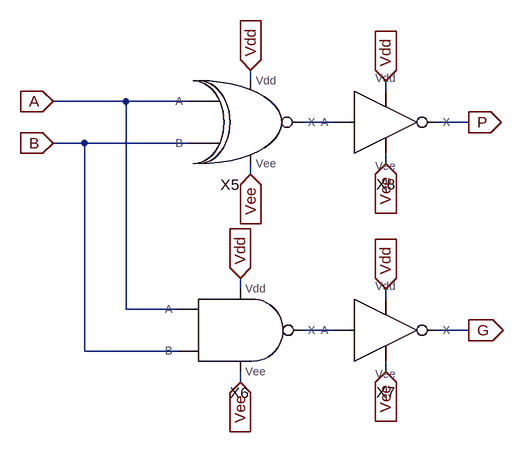
[diagram p0: schematic PG.asc]
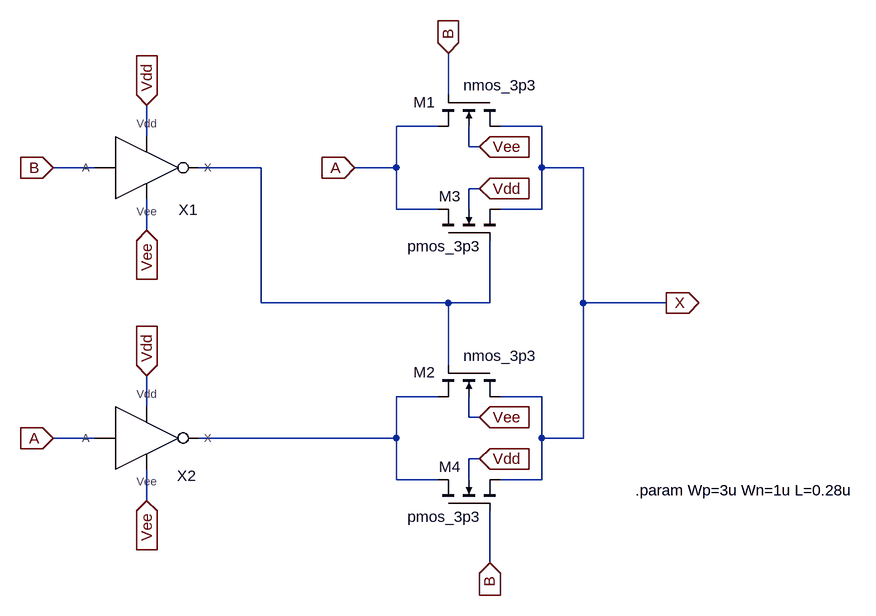
[diagram p1: sub-circuit xnor2x1.asc]
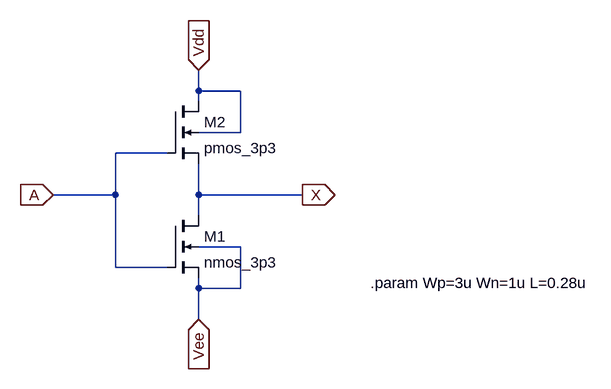
[diagram p2: sub-circuit invx1.asc]
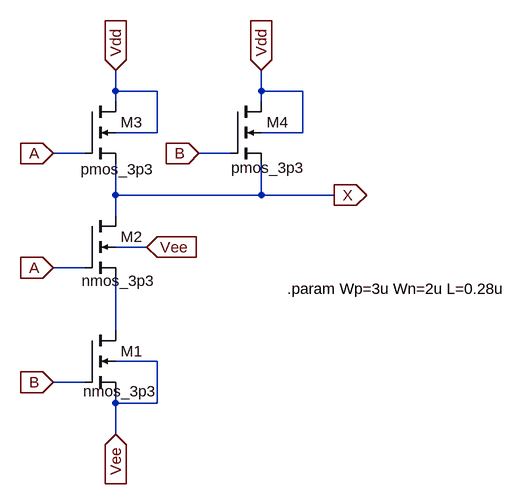
[diagram p3: sub-circuit nand2x1.asc]
PG.asc, the LTspice schematic file:
Version 4.1
SHEET 1 892 680
WIRE 192 -176 192 -192
WIRE 400 -160 400 -176
WIRE 0 -144 -112 -144
WIRE 96 -144 0 -144
WIRE 320 -112 272 -112
WIRE 528 -112 480 -112
WIRE -64 -80 -112 -80
WIRE 96 -80 -64 -80
WIRE 400 -48 400 -64
WIRE 192 -32 192 -48
WIRE 176 144 176 128
WIRE 400 160 400 144
WIRE 0 176 0 -144
WIRE 80 176 0 176
WIRE 320 208 272 208
WIRE 528 208 480 208
WIRE -64 240 -64 -80
WIRE 80 240 -64 240
WIRE 400 272 400 256
WIRE 176 288 176 272
FLAG 192 -32 Vee
IOPIN 192 -32 In
FLAG 176 288 Vee
IOPIN 176 288 In
FLAG 176 128 Vdd
IOPIN 176 128 In
FLAG 192 -192 Vdd
IOPIN 192 -192 In
FLAG 400 -176 Vdd
IOPIN 400 -176 In
FLAG 400 -48 Vee
IOPIN 400 -48 In
FLAG 400 144 Vdd
IOPIN 400 144 In
FLAG 400 272 Vee
IOPIN 400 272 In
FLAG 528 208 G
IOPIN 528 208 Out
FLAG 528 -112 P
IOPIN 528 -112 Out
FLAG -112 -144 A
IOPIN -112 -144 In
FLAG -112 -80 B
IOPIN -112 -80 In
SYMBOL XNOR2x1 160 -112 R0
SYMATTR InstName X5
SYMBOL NAND2x1 176 208 R0
SYMATTR InstName X6
SYMBOL INVx1 400 208 R0
SYMATTR InstName X7
SYMBOL INVx1 400 -112 R0
SYMATTR InstName X8

xnor2x1.asc, the sub-circuit schematic file:
Version 4
SHEET 1 1124 680
WIRE 176 -192 176 -256
WIRE 160 -144 96 -144
WIRE 320 -144 256 -144
WIRE -288 -128 -288 -176
WIRE 208 -112 208 -144
WIRE 224 -112 208 -112
WIRE -368 -80 -432 -80
WIRE -112 -80 -208 -80
WIRE 96 -80 96 -144
WIRE 96 -80 32 -80
WIRE 320 -80 320 -144
WIRE 384 -80 320 -80
WIRE 224 -48 208 -48
WIRE 96 -16 96 -80
WIRE 160 -16 96 -16
WIRE 208 -16 208 -48
WIRE 320 -16 320 -80
WIRE 320 -16 256 -16
WIRE -288 16 -288 -32
WIRE -112 128 -112 -80
WIRE 176 128 -112 128
WIRE 240 128 240 32
WIRE 240 128 176 128
WIRE 384 128 384 -80
WIRE 512 128 384 128
WIRE 176 224 176 128
WIRE 160 272 96 272
WIRE 320 272 256 272
WIRE -288 288 -288 240
WIRE 208 304 208 272
WIRE 224 304 208 304
WIRE -368 336 -432 336
WIRE 96 336 96 272
WIRE 96 336 -208 336
WIRE 320 336 320 272
WIRE 384 336 384 128
WIRE 384 336 320 336
WIRE 224 368 208 368
WIRE 96 400 96 336
WIRE 160 400 96 400
WIRE 208 400 208 368
WIRE 320 400 320 336
WIRE 320 400 256 400
WIRE -288 432 -288 384
WIRE 240 528 240 448
FLAG 32 -80 A
IOPIN 32 -80 In
FLAG 176 -256 B
IOPIN 176 -256 In
FLAG -432 336 A
IOPIN -432 336 In
FLAG -432 -80 B
IOPIN -432 -80 In
FLAG -288 -176 Vdd
IOPIN -288 -176 In
FLAG -288 240 Vdd
IOPIN -288 240 In
FLAG -288 16 Vee
IOPIN -288 16 In
FLAG -288 432 Vee
IOPIN -288 432 In
FLAG 240 528 B
IOPIN 240 528 In
FLAG 512 128 X
IOPIN 512 128 Out
FLAG 224 -48 Vdd
IOPIN 224 -48 In
FLAG 224 -112 Vee
IOPIN 224 -112 In
FLAG 224 304 Vee
IOPIN 224 304 In
FLAG 224 368 Vdd
IOPIN 224 368 In
SYMBOL nmos4 256 -192 R90
WINDOW 0 11 100 VRight 2
WINDOW 3 -15 -57 VRight 2
SYMATTR InstName M1
SYMATTR Value nmos_3p3
SYMATTR Value2 l={L} w={Wn  }
SYMBOL nmos4 160 32 R270
WINDOW 0 68 2 VRight 2
WINDOW 3 -9 -47 VRight 2
SYMATTR InstName M3
SYMATTR Value pmos_3p3
SYMATTR Value2 l={L} w={Wp}
SYMBOL INVx1 -288 -80 R0
WINDOW 0 64 49 Top 2
SYMATTR InstName X1
SYMBOL INVx1 -288 336 R0
WINDOW 0 61 42 Top 2
SYMATTR InstName X2
SYMBOL nmos4 256 224 R90
WINDOW 0 11 100 VRight 2
WINDOW 3 -15 -57 VRight 2
SYMATTR InstName M2
SYMATTR Value nmos_3p3
SYMATTR Value2 l={L} w={Wn}
SYMBOL nmos4 160 448 R270
WINDOW 0 68 2 VRight 2
WINDOW 3 -9 -47 VRight 2
SYMATTR InstName M4
SYMATTR Value pmos_3p3
SYMATTR Value2 l={L} w={Wp}
TEXT 464 416 Left 2 !.param Wp=3u Wn=1u L=0.28u

invx1.asc, the sub-circuit schematic file:
Version 4
SHEET 1 2776 836
WIRE 416 -16 416 -48
WIRE 480 -16 416 -16
WIRE 416 0 416 -16
WIRE 480 48 480 -16
WIRE 480 48 416 48
WIRE 368 80 288 80
WIRE 288 144 288 80
WIRE 288 144 192 144
WIRE 416 144 416 96
WIRE 576 144 416 144
WIRE 416 176 416 144
WIRE 480 224 416 224
WIRE 288 256 288 144
WIRE 368 256 288 256
WIRE 416 288 416 272
WIRE 480 288 480 224
WIRE 480 288 416 288
WIRE 416 336 416 288
FLAG 416 -48 Vdd
IOPIN 416 -48 In
FLAG 192 144 A
IOPIN 192 144 In
FLAG 576 144 X
IOPIN 576 144 Out
FLAG 416 336 Vee
IOPIN 416 336 In
SYMBOL nmos4 368 176 R0
SYMATTR InstName M1
SYMATTR Value nmos_3p3
SYMATTR Value2 l={L} w={Wn}
SYMBOL nmos4 368 0 R0
SYMATTR InstName M2
SYMATTR Value pmos_3p3
SYMATTR Value2 l={L} w={Wp}
TEXT 680 280 Left 2 !.param Wp=3u Wn=1u L=0.28u

nand2x1.asc, the sub-circuit schematic file:
Version 4.1
SHEET 1 900 680
WIRE -96 32 -96 0
WIRE -32 32 -96 32
WIRE 128 32 128 0
WIRE 192 32 128 32
WIRE -96 48 -96 32
WIRE 128 48 128 32
WIRE -32 96 -32 32
WIRE -32 96 -96 96
WIRE 192 96 192 32
WIRE 192 96 128 96
WIRE -144 128 -192 128
WIRE 80 128 32 128
WIRE -96 192 -96 144
WIRE 128 192 128 144
WIRE 128 192 -96 192
WIRE 240 192 128 192
WIRE -96 224 -96 192
WIRE -48 272 -96 272
WIRE -144 304 -192 304
WIRE -96 400 -96 320
WIRE -32 448 -96 448
WIRE -144 480 -192 480
WIRE -96 512 -96 496
WIRE -32 512 -32 448
WIRE -32 512 -96 512
WIRE -96 560 -96 512
FLAG -96 0 Vdd
IOPIN -96 0 In
FLAG -192 128 A
IOPIN -192 128 In
FLAG 240 192 X
IOPIN 240 192 Out
FLAG 128 0 Vdd
IOPIN 128 0 In
FLAG -192 304 A
IOPIN -192 304 In
FLAG -192 480 B
IOPIN -192 480 In
FLAG 32 128 B
IOPIN 32 128 In
FLAG -96 560 Vee
IOPIN -96 560 In
FLAG -48 272 Vee
IOPIN -48 272 In
SYMBOL nmos4 -144 400 R0
WINDOW 3 -2 94 Left 2
SYMATTR Value nmos_3p3
SYMATTR InstName M1
SYMATTR Value2 l={L} w={Wn}
SYMBOL nmos4 -144 48 R0
WINDOW 3 -6 104 Left 2
SYMATTR Value pmos_3p3
SYMATTR InstName M3
SYMATTR Value2 l={L} w={Wp}
SYMBOL nmos4 80 48 R0
WINDOW 3 2 102 Left 2
SYMATTR Value pmos_3p3
SYMATTR InstName M4
SYMATTR Value2 l={L} w={Wp}
SYMBOL nmos4 -144 224 R0
WINDOW 3 -4 100 Left 2
SYMATTR Value nmos_3p3
SYMATTR InstName M2
SYMATTR Value2 l={L} w={Wn}
TEXT 168 336 Left 2 !.param Wp=3u Wn=2u L=0.28u

The netlist it stands for:
* PG.asc
X§X5 A B Vdd Vee N001 xnor2x1
X§X6 A B Vdd N002 Vee nand2x1
X§X7 N002 Vdd G Vee invx1
X§X8 N001 Vdd P Vee invx1

* block symbol definitions
.subckt xnor2x1 A B Vdd Vee X
M1 X B A Vee nmos_3p3 l={L} w={Wn  }
M3 A N001 X Vdd pmos_3p3 l={L} w={Wp}
XX1 B Vdd N001 Vee invx1
XX2 A Vdd N002 Vee invx1
M2 X N001 N002 Vee nmos_3p3 l={L} w={Wn}
M4 N002 B X Vdd pmos_3p3 l={L} w={Wp}
.param Wp=3u Wn=1u L=0.28u
.ends xnor2x1

.subckt invx1 A Vdd X Vee
M1 X A Vee Vee nmos_3p3 l={L} w={Wn}
M2 Vdd A X Vdd pmos_3p3 l={L} w={Wp}
.param Wp=3u Wn=1u L=0.28u
.ends invx1

.subckt nand2x1 A B Vdd X Vee
M1 N001 B Vee Vee nmos_3p3 l={L} w={Wn}
M3 Vdd A X Vdd pmos_3p3 l={L} w={Wp}
M4 Vdd B X Vdd pmos_3p3 l={L} w={Wp}
M2 X A N001 Vee nmos_3p3 l={L} w={Wn}
.param Wp=3u Wn=2u L=0.28u
.ends nand2x1

.model NMOS NMOS
.model PMOS PMOS
.lib standard.mos
.backanno
.end